# Altium schematic sheet Switches.SchDoc
size A; SheetNumber: 2; SheetTotal: 3; SPICEModelCacheMQZXYCRS: <root> / <DocumentId>MQZXYCRS</DocumentId> / <CacheFrame Number="0"> / <Model Name="diode" Kind="MDL"> / <Text>*Default Diode / *Diode Pinout: A,K / .MODEL DIODE D()</Text> / </Model> / </CacheFrame> / </root>
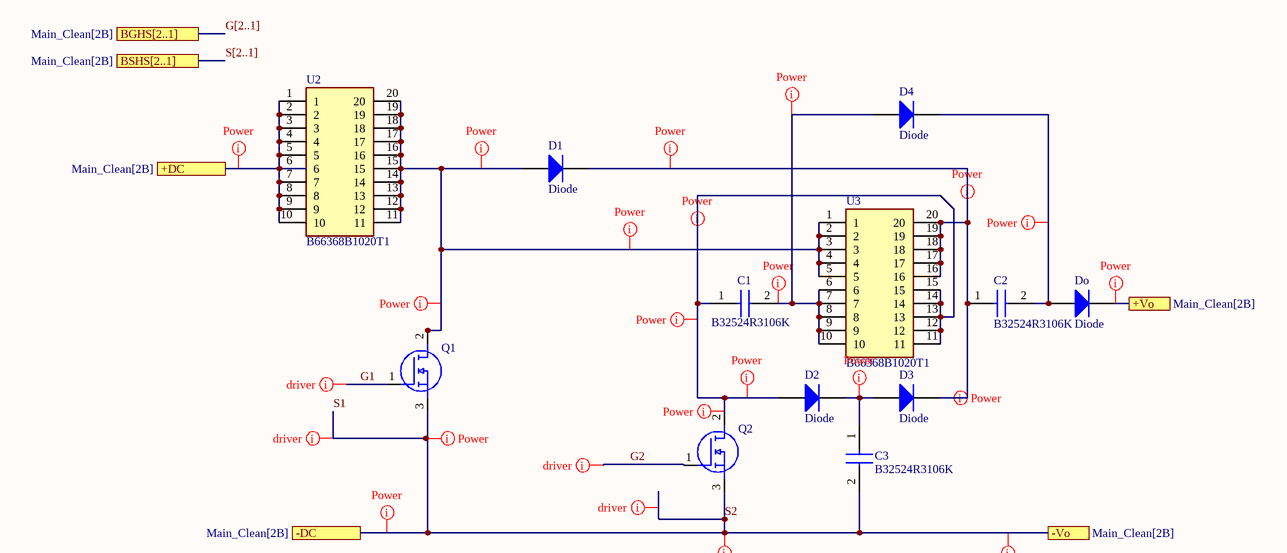
[diagram p0: Switches.SchDoc]

## Parts
C1  B32524R3106K  [B32524R3106K]
C2  B32524R3106K  [B32524R3106K]
C3  B32524R3106K  [B32524R3106K]
D1  Diode  [Dpak]
D2  Diode  [Dpak]
D3  Diode  [Dpak]
D4  Diode  [Dpak]
Do  Diode  [Dpak]
Q1  IPB048N15N5LFATMA1  [D2PAK]  (value not drawn)
Q2  IPB048N15N5LFATMA1  [D2PAK]  (value not drawn)
U2  B66368B1020T1  [B66368B1020T1]
U3  B66368B1020T1  [B66368B1020T1]

## Ports
+DC (see Main_Clean[2B]), +Vo (see Main_Clean[2B]), -DC (see Main_Clean[2B]), -Vo (see Main_Clean[2B]), BGHS[2..1] (see Main_Clean[2B]), BSHS[2..1] (see Main_Clean[2B])

## Nets
+DC: U2.1 U2.2 U2.3 U2.4 U2.5 U2.6 U2.7 U2.8 U2.9 U2.10 ; port +DC
+Vo: Do.2(K) ; port +Vo
G1: Q1.1(G)
G2: Q2.1(G)
S1: C3.2 Q1.3(S) Q2.3(S) ; port -DC, port -Vo  [also labelled S2]
NetC1_1: C1.1 D2.1(A) Q2.2(D) U3.11 U3.12 U3.13 U3.14 U3.15
NetC1_2: C1.2 D4.1(A) U3.6 U3.7 U3.8 U3.9 U3.10
NetC2_1: C2.1 D1.2(K) D3.2(K) U3.16 U3.17 U3.18 U3.19 U3.20
NetC2_2: C2.2 D4.2(K) Do.1(A)
NetC3_1: C3.1 D2.2(K) D3.1(A)
NetD1_1: D1.1(A) Q1.2(D) U2.11 U2.12 U2.13 U2.14 U2.15 U2.16 U2.17 U2.18 U2.19 U2.20 U3.1 U3.2 U3.3 U3.4 U3.5

## Buses and harness runs
bus G[2..1] = port BGHS[2..1]
bus S[2..1] = port BSHS[2..1]

## Layout directives
net class Power: +DC, +Vo, G1, G2, NetC1_1, NetC1_2, NetC2_1, NetC2_2, NetC3_1, NetD1_1, S1

## Library data of the parts
C1-C3 = B32524R3106K: Capacitor; Manufacturer_Name: TDK; Datasheet Link: https://componentsearchengine.com/Datasheets/1/B32524R3106K.pdf; Height: 21.5mm; Manufacturer_Part_Number: B32524R3106K; Mouser Part Number: 871-B32524R3106K; Mouser Price/Stock: https://www.mouser.co.uk/ProductDetail/EPCOS-TDK/B32524R3106K?qs=xEJ61ozf1a2Uwb6OZwaixw%3D%3D; Arrow Part Number: B32524R3106K; Arrow Price/Stock: https://www.arrow.com/en/products/b32524r3106k/epcos-tdk?region=nac
D1-D4 Do = Diode: Default Diode; Published: 8-Jun-2000; LatestRevisionDate: 17-Jul-2002; LatestRevisionNote: Re-released for DXP Platform.; PackageVersion: Sep-1996; PackageReference: SMC; Publisher: Altium Limited; PackageDescription: DO-214-AB/SMC; 2 C-Bend Leads; Body 7.9 x 5.9 mm, inc. leads (LxW); Code_JEDEC: DO-214-AB
Q1 Q2 = IPB048N15N5LFATMA1: Trans MOSFET N-CH 150V 120A 3-Pin(2+Tab) D2PAK T/R; Manufacturer_Name: Infineon; Geometry.Height: 4.82mm; Mouser Part Number: 726-IPB048N15N5LF; Mouser Price/Stock: https://www.mouser.co.uk/ProductDetail/Infineon-Technologies/IPB048N15N5LFATMA1?qs=HXFqYaX1Q2ypITzfwKA8Fg%3D%3D; Manufacturer_Part_Number: IPB048N15N5LFATMA1; Datasheet Link: https://componentsearchengine.com/Datasheets/1/IPB048N15N5LFATMA1.pdf
U2 U3 = B66368B1020T1: Undefined or Miscellaneous; Manufacturer_Name: TDK; Datasheet Link: https://www.mouser.com/datasheet/2/400/etd_49_25_16-1220447.pdf; Height: 40.9mm; Manufacturer_Part_Number: B66368B1020T1; Mouser Part Number: 871-B66368B1020T1; Mouser Price/Stock: https://www.mouser.co.uk/ProductDetail/EPCOS-TDK/B66368B1020T1?qs=fWY6Jreybtns4G%252BQgkB59A%3D%3D; Arrow Part Number: B66368B1020T1; Arrow Price/Stock: https://www.arrow.com/en/products/b66368b1020t1/epcos-tdk?region=nac